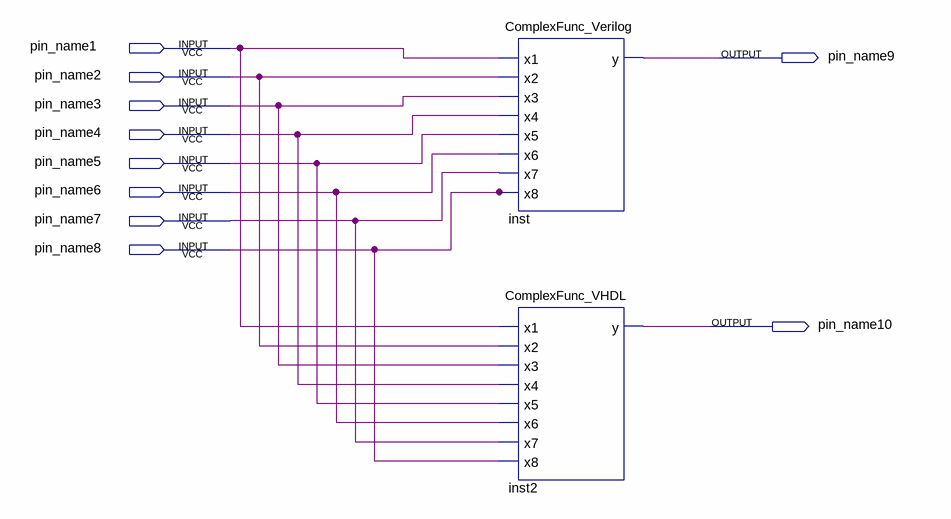
[diagram p0: schematic sheet]
// Quartus schematic lab2_ComplexLogicalFunctions.bdf as structural Verilog: 2 symbols, 10 pins
module lab2_ComplexLogicalFunctions (
  input  pin_name1,
  input  pin_name2,
  input  pin_name3,
  input  pin_name4,
  input  pin_name5,
  input  pin_name6,
  input  pin_name7,
  input  pin_name8,
  output pin_name9,
  output pin_name10
);

  ComplexFunc_Verilog inst (
    .x1(pin_name1), .x2(pin_name2), .x3(pin_name3), .x4(pin_name4), .x5(pin_name5), .x6(pin_name6),
    .x7(pin_name7), .x8(pin_name8), .y(pin_name9));
  ComplexFunc_VHDL inst2 (
    .x1(pin_name1), .x2(pin_name2), .x3(pin_name3), .x4(pin_name4), .x5(pin_name5), .x6(pin_name6),
    .x7(pin_name7), .x8(pin_name8), .y(pin_name10));
endmodule
